# Altium schematic sheet EX_POWER.SchDoc
size A4; SheetNumber: 6; SheetTotal: 6
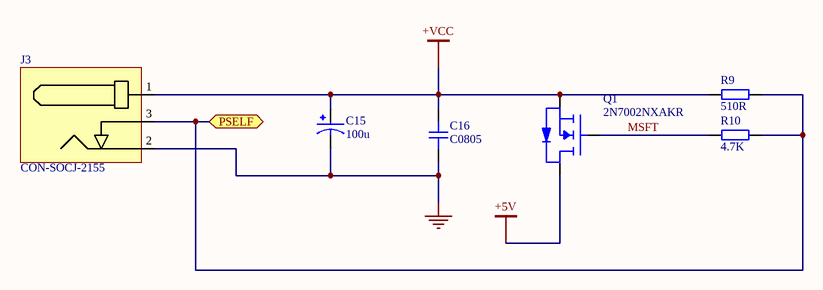
[diagram p0: EX_POWER.SchDoc]

## Parts
C15  100u  [CAP_EEEHA0J101WR]
C16  C0805  [CAP_0805]
J3  CON-SOCJ-2155  [CON-SOCJ-2155]
Q1  2N7002NXAKR  [SSM3J338R,LF-SOT23-F]
R9  510R  [RES_0603]
R10  4.7K  [RES_0603]

## Ports
PSELF (bidir)

## Nets
+5V: Q1.D
+VCC: C15.1 C16.2 J3.1 Q1.S R9.1
GND: C15.2 C16.1 J3.2
MSFT: Q1.G R10.1
PSELF: J3.3 R9.2 R10.2 ; port PSELF

## Library data of the parts
C15 = EEEHA0J101WR: CAPACITOR ALUM ELEC, 100UF, 20%, 6.3V, S; CAPACITOR ALUM ELEC, 100UF, 20%, 6.3V, SMD; Product Range:PANASONIC - HA Series; Capacitance:100ÂµF; Capacitance Tolerance:Â± 20%; Voltage Rating:6.3V; Capacitor Case Style:Radial Can - SMD; Diameter:5mm; Height:5.4mm; Series:HA; MF: Panasonic Electronic; MP: EEE-HA0J101WR; Availability: In Stock; Check_prices: https://www.snapeda.com/parts/EEE-HA0J101WR/Panasonic%20Electronic%20Components/view-part/2733110/?ref=eda; SnapEDA_Link: https://www.snapeda.com/parts/EEE-HA0J101WR/Panasonic%20Electronic%20Components/view-part/2733110/?ref=snap; Purchase-URL: https://pricing.snapeda.com/search/part/EEE-HA0J101WR/?ref=eda; Package: RADIAL-2 Panasonic; Value: *; Price: None
C16 = CAP_0805: Capacitor SMD 0805; Manufacturer: *; Manufacturer Part Number: *; Distributor Link: *; LCSC: *; Rating: *; Dielectric: *
J3 = CON-SOCJ-2155: DC Barrell Jack 2.1mm 30V 2.5A THT; Manufacturer: Gravitech; Manufacturer Part Number: CON-SOCJ-2155
Q1 = 2N7002NXAKR: MOSFET N-Channel Vds=60V Id=300mA with ESD Protection; Manufacturer: Nexperia; Manufacturer Part Number: 2N7002NXAKR
R9 R10 = RES_0603: Resistor SMD 0603; Manufacturer: *; Manufacturer Part Number: *; Distributor Link: *; LCSC: *